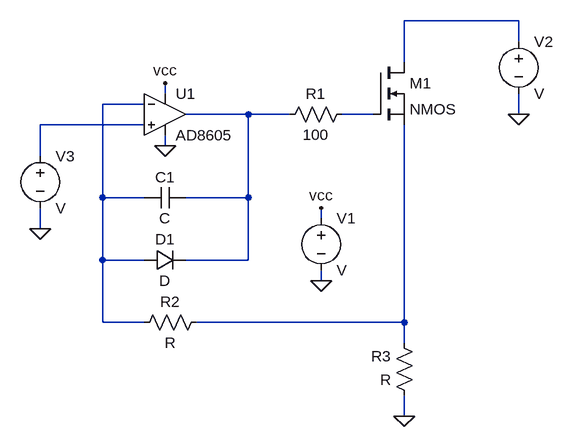
[diagram p0: schematic Draft1.asc]
Draft1.asc, the LTspice schematic file:
Version 4
SHEET 1 880 680
WIRE 736 0 560 0
WIRE 736 32 736 0
WIRE 560 64 560 0
WIRE 192 112 192 96
WIRE 160 128 96 128
WIRE 320 144 224 144
WIRE 384 144 320 144
WIRE 512 144 464 144
WIRE 736 144 736 112
WIRE 160 160 0 160
WIRE 192 192 192 176
WIRE 0 208 0 160
WIRE 96 272 96 128
WIRE 160 272 96 272
WIRE 320 272 320 144
WIRE 320 272 224 272
WIRE 432 304 432 288
WIRE 0 320 0 288
WIRE 96 368 96 272
WIRE 160 368 96 368
WIRE 320 368 320 272
WIRE 320 368 224 368
WIRE 432 400 432 384
WIRE 96 464 96 368
WIRE 160 464 96 464
WIRE 560 464 560 160
WIRE 560 464 240 464
WIRE 560 496 560 464
WIRE 560 608 560 576
FLAG 432 400 0
FLAG 432 288 vcc
FLAG 192 96 vcc
FLAG 192 192 0
FLAG 736 144 0
FLAG 560 608 0
FLAG 0 320 0
SYMBOL OpAmps\\AD8605 192 80 R0
SYMATTR InstName U1
SYMBOL voltage 432 288 R0
SYMATTR InstName V1
SYMBOL res 480 128 R90
WINDOW 0 0 56 VBottom 2
WINDOW 3 32 56 VTop 2
SYMATTR InstName R1
SYMATTR Value 100
SYMBOL nmos 512 64 R0
SYMATTR InstName M1
SYMBOL cap 224 256 R90
WINDOW 0 0 32 VBottom 2
WINDOW 3 32 32 VTop 2
SYMATTR InstName C1
SYMBOL diode 160 384 R270
WINDOW 0 32 32 VTop 2
WINDOW 3 0 32 VBottom 2
SYMATTR InstName D1
SYMBOL res 256 448 R90
WINDOW 0 0 56 VBottom 2
WINDOW 3 32 56 VTop 2
SYMATTR InstName R2
SYMBOL res 576 592 R180
WINDOW 0 36 76 Left 2
WINDOW 3 36 40 Left 2
SYMATTR InstName R3
SYMBOL voltage 736 16 R0
SYMATTR InstName V2
SYMBOL voltage 0 192 R0
SYMATTR InstName V3

The netlist it stands for:
* Draft1.asc
XU1 N005 N002 vcc 0 N003 AD8605  ; pins In+ In- V+ V- OUT
V1 vcc 0 V
R1 N004 N003 100
M1 N001 N004 N006 N006 NMOS
C1 N003 N002 C
D1 N002 N003 D
R2 N006 N002 R
R3 0 N006 R
V2 N001 0 V
V3 N005 0 V
.model D D
.lib standard.dio
.model NMOS NMOS
.model PMOS PMOS
.lib standard.mos
.lib ADI.lib
.backanno
.end